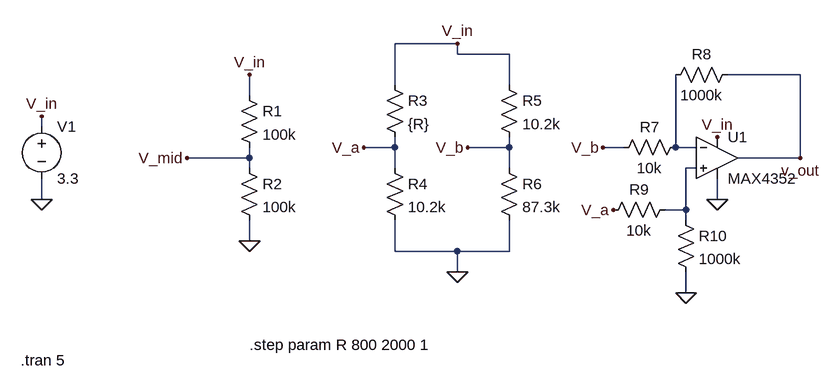
[diagram p0: schematic Draft2.asc]
Draft2.asc, the LTspice schematic file:
Version 4.1
SHEET 1 964 680
WIRE 384 32 288 32
WIRE 384 48 384 32
WIRE 464 48 384 48
WIRE 912 80 800 80
WIRE 288 96 288 32
WIRE 464 96 464 48
WIRE 64 112 64 80
WIRE -256 160 -256 144
WIRE 288 192 288 176
WIRE 288 192 240 192
WIRE 464 192 464 176
WIRE 464 192 400 192
WIRE 640 192 608 192
WIRE 720 192 720 80
WIRE 752 192 720 192
WIRE 64 208 64 192
WIRE 64 208 -32 208
WIRE 912 208 912 80
WIRE 912 208 816 208
WIRE 64 224 64 208
WIRE 288 224 288 192
WIRE 464 224 464 192
WIRE 752 224 736 224
WIRE -256 272 -256 240
WIRE 784 272 784 240
WIRE 736 288 736 224
WIRE 736 288 704 288
WIRE 736 304 736 288
WIRE 64 336 64 304
WIRE 288 352 288 304
WIRE 384 352 288 352
WIRE 464 352 464 304
WIRE 464 352 384 352
WIRE 384 384 384 352
WIRE 736 416 736 384
FLAG -256 272 0
FLAG -256 144 V_in
FLAG 64 336 0
FLAG -32 208 V_mid
FLAG 64 80 V_in
FLAG 384 384 0
FLAG 384 32 V_in
FLAG 240 192 V_a
FLAG 400 192 V_b
FLAG 608 192 V_b
FLAG 784 176 V_in
FLAG 784 272 0
FLAG 624 288 V_a
FLAG 736 416 0
FLAG 912 208 v_out
SYMBOL res 48 96 R0
SYMATTR InstName R1
SYMATTR Value 100k
SYMBOL res 48 208 R0
SYMATTR InstName R2
SYMATTR Value 100k
SYMBOL voltage -256 144 R0
WINDOW 123 0 0 Left 0
WINDOW 39 0 0 Left 0
SYMATTR InstName V1
SYMATTR Value 3.3
SYMBOL res 272 80 R0
SYMATTR InstName R3
SYMATTR Value {R}
SYMBOL res 272 208 R0
SYMATTR InstName R4
SYMATTR Value 10.2k
SYMBOL res 448 80 R0
SYMATTR InstName R5
SYMATTR Value 10.2k
SYMBOL res 448 208 R0
SYMATTR InstName R6
SYMATTR Value 87.3k
SYMBOL OpAmps\\MAX4352 784 144 R0
SYMATTR InstName U1
SYMBOL res 736 176 R90
WINDOW 0 0 56 VBottom 2
WINDOW 3 32 56 VTop 2
SYMATTR InstName R7
SYMATTR Value 10k
SYMBOL res 816 64 R90
WINDOW 0 0 56 VBottom 2
WINDOW 3 32 56 VTop 2
SYMATTR InstName R8
SYMATTR Value 1000k
SYMBOL res 720 272 R90
WINDOW 0 0 56 VBottom 2
WINDOW 3 32 56 VTop 2
SYMATTR InstName R9
SYMATTR Value 10k
SYMBOL res 720 288 R0
SYMATTR InstName R10
SYMATTR Value 1000k
TEXT 64 496 Left 2 !.step param R 800 2000 1
TEXT -288 520 Left 2 !.tran 5

The netlist it stands for:
* Draft2.asc
R1 V_in V_mid 100k
R2 V_mid 0 100k
V1 V_in 0 3.3
R3 V_in V_a {R}
R4 V_a 0 10.2k
R5 V_in V_b 10.2k
R6 V_b 0 87.3k
X§U1 N002 N001 V_in 0 v_out MAX4352  ; pins In+ In- V+ V- OUT
R7 N001 V_b 10k
R8 v_out N001 1000k
R9 N002 V_a 10k
R10 N002 0 1000k
.step param R 800 2000 1
.tran 5
.backanno
.end